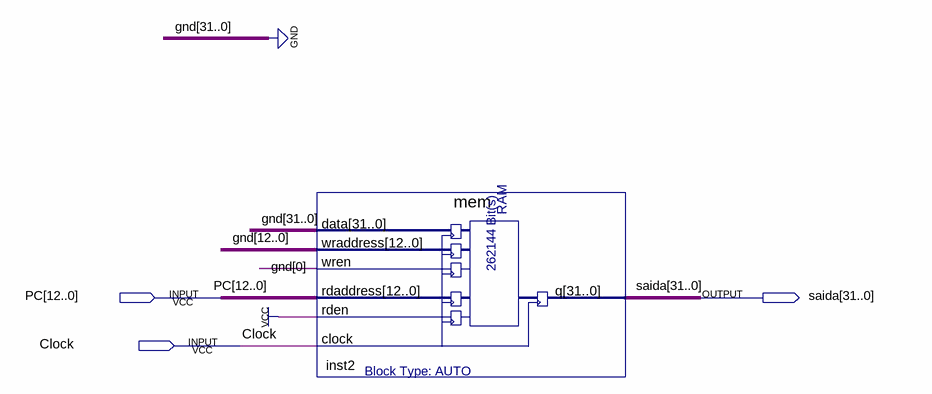
[diagram p0: schematic sheet]
// Quartus schematic Mem_Instruct.bdf as structural Verilog: 1 symbols, 3 pins
module Mem_Instruct (
  input  [12:0] PC,
  input  Clock,
  output [31:0] saida
);

  mem inst2 (
    .data({32{1'b0}}), .wraddress({13{1'b0}}), .wren(1'b0), .rdaddress(PC), .rden(1'b1), .clock(Clock),
    .q(saida));
endmodule
